# EAGLE schematic G624C (EAGLE 6.6.0)
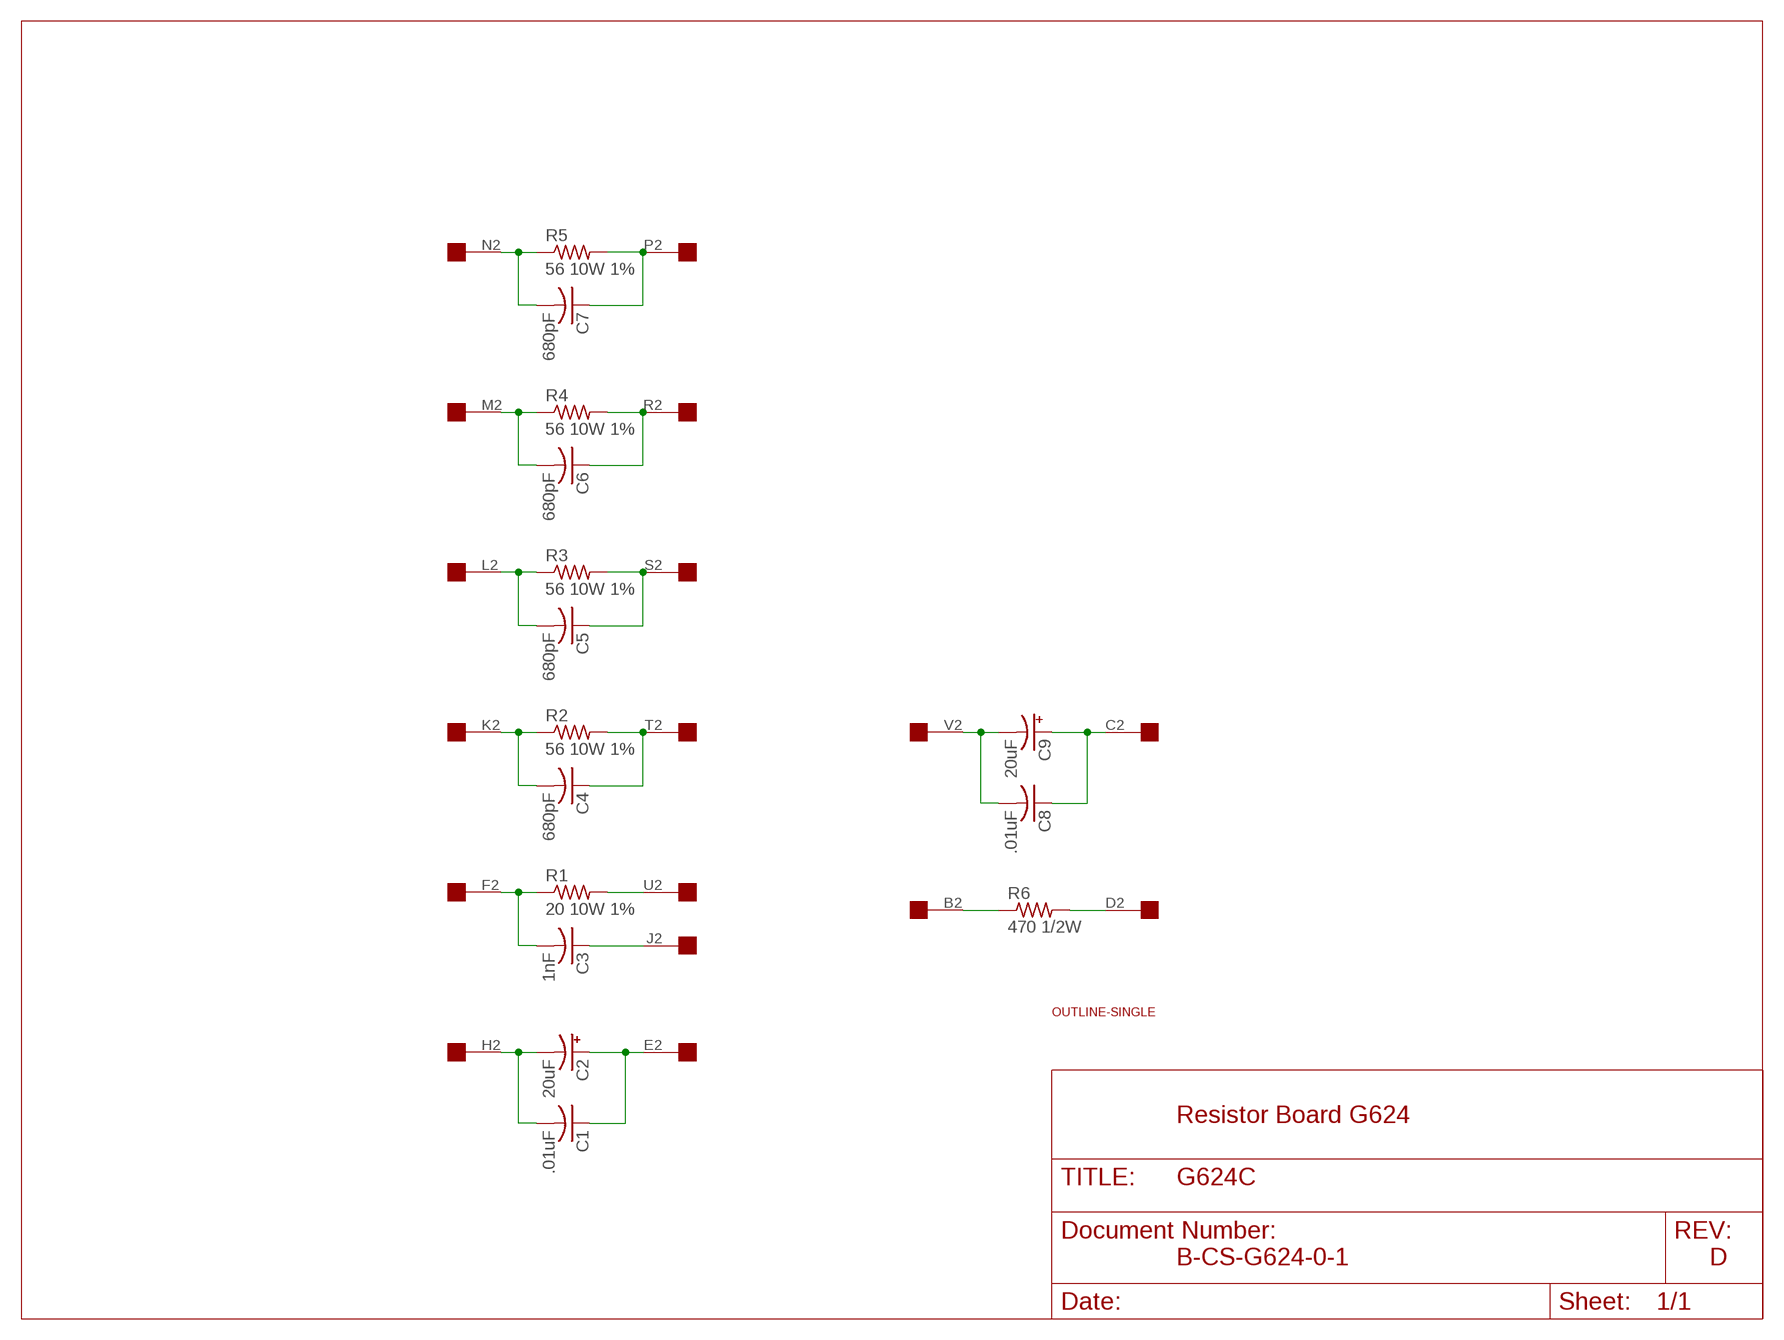
[diagram p0: schematic, sheet 1]

## Parts
C1  .01uF  C-US050-025X075  [C050-025X075]
C2  20uF  CPOL-USE28-8AXIAL  [E28-8]
C3  1nF  C-US050-025X075  [C050-025X075]
C4  680pF  C-US150-054X183  [C150-054X183]
C5  680pF  C-US150-054X183  [C150-054X183]
C6  680pF  C-US050-025X075  [C050-025X075]
C7  680pF  C-US050-025X075  [C050-025X075]
C8  .01uF  C-US050-025X075  [C050-025X075]
C9  20uF  CPOL-USE28-8AXIAL  [E28-8]
R1  20 10W 1%  R-US_0944/51  [0944/51]
R2  56 10W 1%  R-US_0944/51  [0944/51]
R3  56 10W 1%  R-US_0944/51  [0944/51]
R4  56 10W 1%  R-US_0944/51  [0944/51]
R5  56 10W 1%  R-US_0944/51  [0944/51]
R6  470 1/2W  R-US_0411/15  [0411/15]
U$1  EDGE-1  [EDGE-CON1]
U$2  OUTLINE-SINGLE  [SINGLE]

## Nets
N$1: C3.2 R1.1 U$1.F2
N$2: R1.2 U$1.U2
N$3: C8.2 C9.- U$1.V2
N$4: C8.1 C9.+ U$1.C2
N$5: C7.2 R5.1 U$1.N2
N$6: C7.1 R5.2 U$1.P2
N$7: C4.2 R2.1 U$1.K2
N$8: C4.1 R2.2 U$1.T2
N$9: C5.1 R3.2 U$1.S2
N$10: C5.2 R3.1 U$1.L2
N$11: C6.2 R4.1 U$1.M2
N$12: C6.1 R4.2 U$1.R2
N$13: C1.2 C2.- U$1.H2
N$14: C1.1 C2.+ U$1.E2
N$15: R6.1 U$1.B2
N$16: R6.2 U$1.D2
N$17: C3.1 U$1.J2
Unconnected: U$1.A2

## Notes on the sheet
- Resistor Board G624
- B-CS-G624-0-1 | D

## Library data of the parts
C1 C3-C8 = rcl:C-US: CAPACITOR, American symbol
C2 C9 = dec-con:CPOL-USE28-8AXIAL: Large Electrolytic, grin 1.1"
R1-R5 = dec-con:R-US_0944/51: Power Resistor, 2" grid
R6 = rcl:R-US_: RESISTOR, American symbol
U$1 = dec-con:EDGE-1: Single-Sided DEC Edge Connector -- (side 2)
U$2 = dec-con:OUTLINE-*: Board outlines for DEC boards.